# Altium schematic sheet encode and decode 2.SchDoc
size A4; SheetNumber: 3; SheetTotal: 5
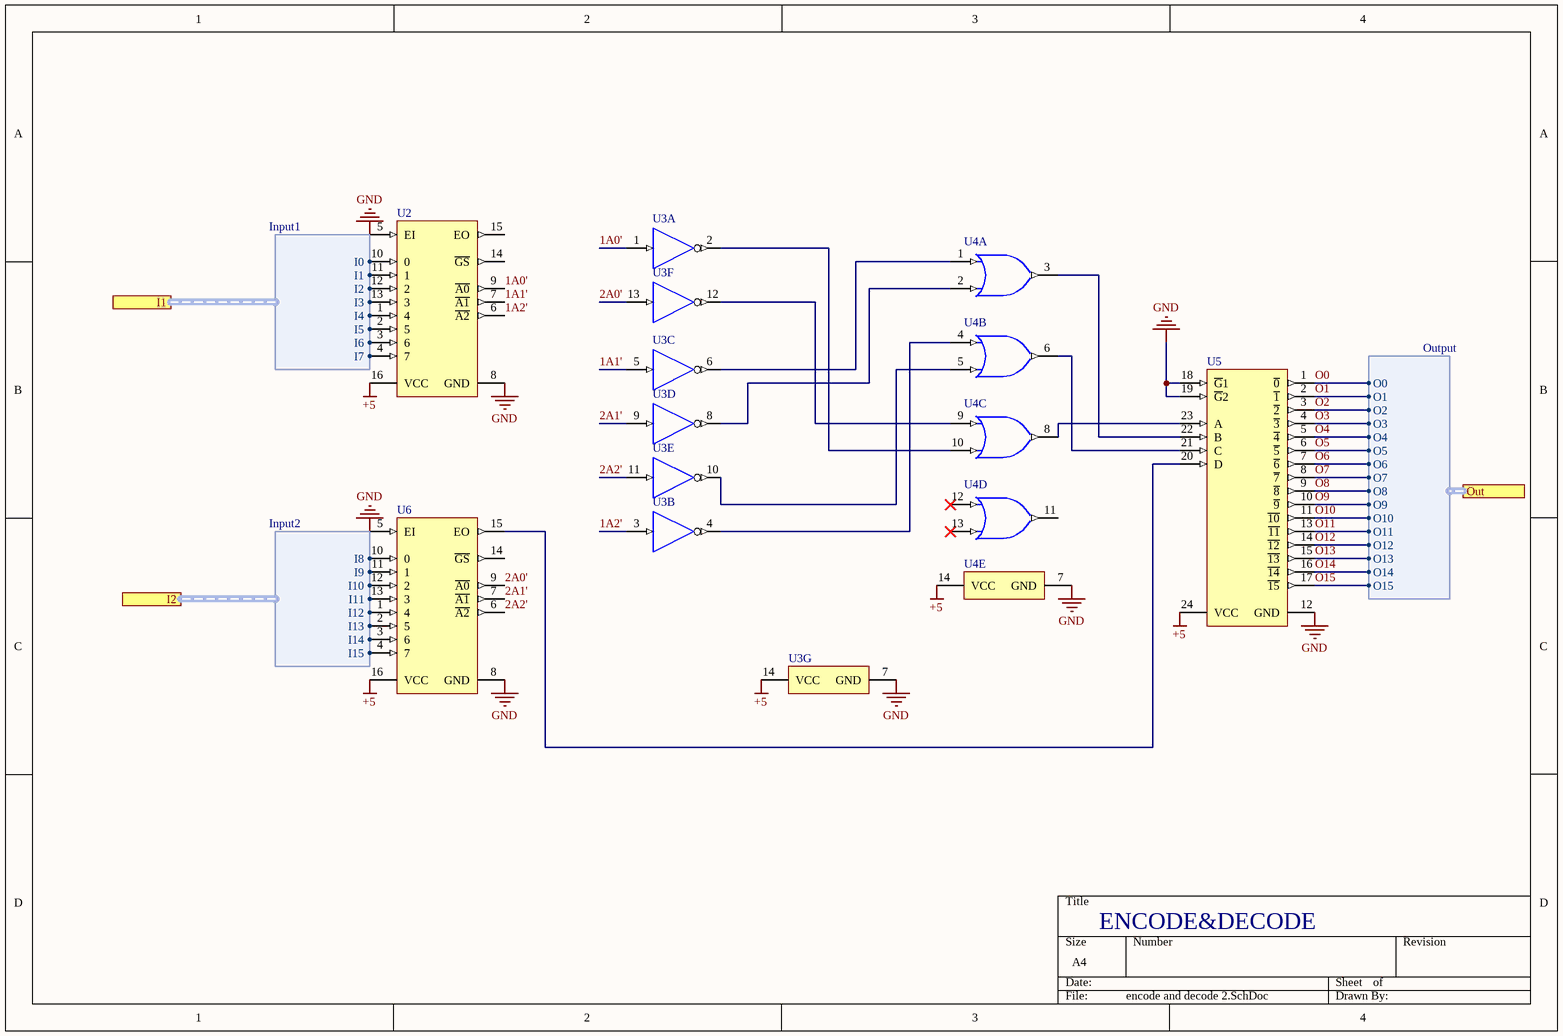
[diagram p0: encode and decode 2.SchDoc]

## Parts
U2  SN74LS148N  [N0016A]  (value not drawn)
U3  SN74HCU04N  [N0014A]  (value not drawn)  (parts A,B,C,D,E,F,G of 7)
U4  SN7432N  [N0014A]  (value not drawn)  (parts A,B,C,D,E of 5)
U5  SN74154N  [N0024A]  (value not drawn)
U6  SN74LS148N  [N0016A]  (value not drawn)

## Ports
I1 (harness Input1, see switch 2[1B]), I2 (harness Input2, see switch 2[2B]), Out (harness Output, see AND operations 2[1C])

## Harnesses
Output: O0, O1, O2, O3, O4, O5, O6, O7, O9, O8, O10, O11, O12, O13, O14, O15
Input1: I0, I1, I2, I3, I4, I5, I6, I7
Input2: I8, I9, I10, I11, I12, I13, I14, I15

## Nets
+5: U2.16(VCC) U3.14(VCC) U4.14(VCC) U5.24(VCC) U6.16(VCC)
GND: U2.5(EI) U2.8(GND) U3.7(GND) U4.7(GND) U5.12(GND) U5.18(~{G}1) U5.19(~{G}2) U6.5(EI) U6.8(GND)
1A0': U2.9(~{A0}) U3.1(1A)
1A1': U2.7(~{A1}) U3.5(3A)
1A2': U2.6(~{A2}) U3.3(2A)
2A0': U3.13(6A) U6.9(~{A0})
2A1': U3.9(4A) U6.7(~{A1})
2A2': U3.11(5A) U6.6(~{A2})
O0: U5.1(~{0}) ; port Out.O0
O1: U5.2(~{1}) ; port Out.O1
O2: U5.3(~{2}) ; port Out.O2
O3: U5.4(~{3}) ; port Out.O3
O4: U5.5(~{4}) ; port Out.O4
O5: U5.6(~{5}) ; port Out.O5
O6: U5.7(~{6}) ; port Out.O6
O7: U5.8(~{7}) ; port Out.O7
O8: U5.9(~{8}) ; port Out.O8
O9: U5.10(~{9}) ; port Out.O9
O10: U5.11(~{10}) ; port Out.O10
O11: U5.13(~{11}) ; port Out.O11
O12: U5.14(~{12}) ; port Out.O12
O13: U5.15(~{13}) ; port Out.O13
O14: U5.16(~{14}) ; port Out.O14
O15: U5.17(~{15}) ; port Out.O15
NetU2_1: U2.1(4) ; port I1.I4
NetU2_2: U2.2(5) ; port I1.I5
NetU2_3: U2.3(6) ; port I1.I6
NetU2_4: U2.4(7) ; port I1.I7
NetU2_10: U2.10(0) ; port I1.I0
NetU2_11: U2.11(1) ; port I1.I1
NetU2_12: U2.12(2) ; port I1.I2
NetU2_13: U2.13(3) ; port I1.I3
NetU3_2: U3.2(~{1Y}) U4.10(3B)
NetU3_4: U3.4(~{2Y}) U4.4(2A)
NetU3_6: U3.6(~{3Y}) U4.1(1A)
NetU3_8: U3.8(~{4Y}) U4.2(1B)
NetU3_10: U3.10(~{5Y}) U4.5(2B)
NetU3_12: U3.12(~{6Y}) U4.9(3A)
NetU4_3: U4.3(1Y) U5.22(B)
NetU4_6: U4.6(2Y) U5.21(C)
NetU4_8: U4.8(3Y) U5.23(A)
NetU5_20: U5.20(D) U6.15(EO)
NetU6_1: U6.1(4) ; port I2.I12
NetU6_2: U6.2(5) ; port I2.I13
NetU6_3: U6.3(6) ; port I2.I14
NetU6_4: U6.4(7) ; port I2.I15
NetU6_10: U6.10(0) ; port I2.I8
NetU6_11: U6.11(1) ; port I2.I9
NetU6_12: U6.12(2) ; port I2.I10
NetU6_13: U6.13(3) ; port I2.I11

Not connected (* = marked no-connect by the designer): U2 14(~{GS}) 15(EO); U4 11(4Y) 12(4A)* 13(4B)*; U6 14(~{GS})

## Notes on the sheet
- ENCODE&DECODE

## Library data of the parts
U2 U6 = CMP-1633-00673-2: 8-line to 3-line priority encoder, N0016A, TUBE; Manufacturer: Texas Instruments; Technology Family: LS; Channels(#): 1; Function: Encoder/Multiplexer; Schmitt Trigger: No; Output Drive (IOL/IOH)(Max)(mA): 8/-0.4; Bits(#): 8; Configuration: 8：3; Input Type: TTL; tpd @ Nom Voltage(Max)(ns): 19; VCC(Min)(V): 4.75; F @ Nom Voltage(Max)(Mhz): 35; ICC @ Nom Voltage(Max)(mA): 20; VCC(Max)(V): 5.25; Rating: Catalog; Voltage(Nom)(V): 5; Generic Part Number: SN74LS148; PackageReference: N0016A; Output Type: TTL; Operating Temperature Range(C): 0 to 70; Type: Standard; DatasheetVersion: SDLS053B; Code_JEDEC: MS-001
U3 = CMP-1615-00910-2: Hex Inverters, N0014A, TUBE; Manufacturer: Texas Instruments; Technology Family: HC; Bits(#): 6; Schmitt Trigger: No; Output Drive (IOL/IOH)(Max)(mA): -4/4; Input Type: CMOS; F @ Nom Voltage(Max)(Mhz): 20; VCC(Min)(V): 2; Voltage(Nom)(V): 5; ICC @ Nom Voltage(Max)(mA): 0.02; Rating: Catalog; Operating Temperature Range(C): -40 to 85; Generic Part Number: SN74HCU04; VCC(Max)(V): 6; PackageReference: N0014A; tpd @ Nom Voltage(Max)(ns): 20; Output Type: CMOS; Code_JEDEC: MS-001; DatasheetVersion: SCLS079E
U4 = CMP-1573-00140-3: Quad 2-input positive-OR gates, N0014A, TUBE; Manufacturer: Texas Instruments; Generic Part Number: SN7432; VCC(Max)(V): 5.25; Voltage(Nom)(V): 5; VCC(Min)(V): 4.75; F @ Nom Voltage(Max)(Mhz): 100; Output Type: TTL; Output Drive (IOL/IOH)(Max)(mA): 0.8/-16; ICC @ Nom Voltage(Max)(mA): 0.038; Bits(#): 4; tpd @ Nom Voltage(Max)(ns): 22; Rating: Catalog; PackageVersion: http://www.ti.com/lit/ml/mpdi002c/mpdi002c.pdf; Operating Temperature Range(C): 0 to 70; DatasheetVersion: SDLS100; Code_JEDEC: MS-001; Input Type: TTL; PackageReference: N0014A
U5 = CMP-1633-00734-2: 4-Line To 16-Line Decoders/Demultiplexers, N0024A, TUBE; Manufacturer: Texas Instruments; Generic Part Number: SN74154; PackageReference: N0024A; Code_JEDEC: MS-011; DatasheetVersion: SDLS056